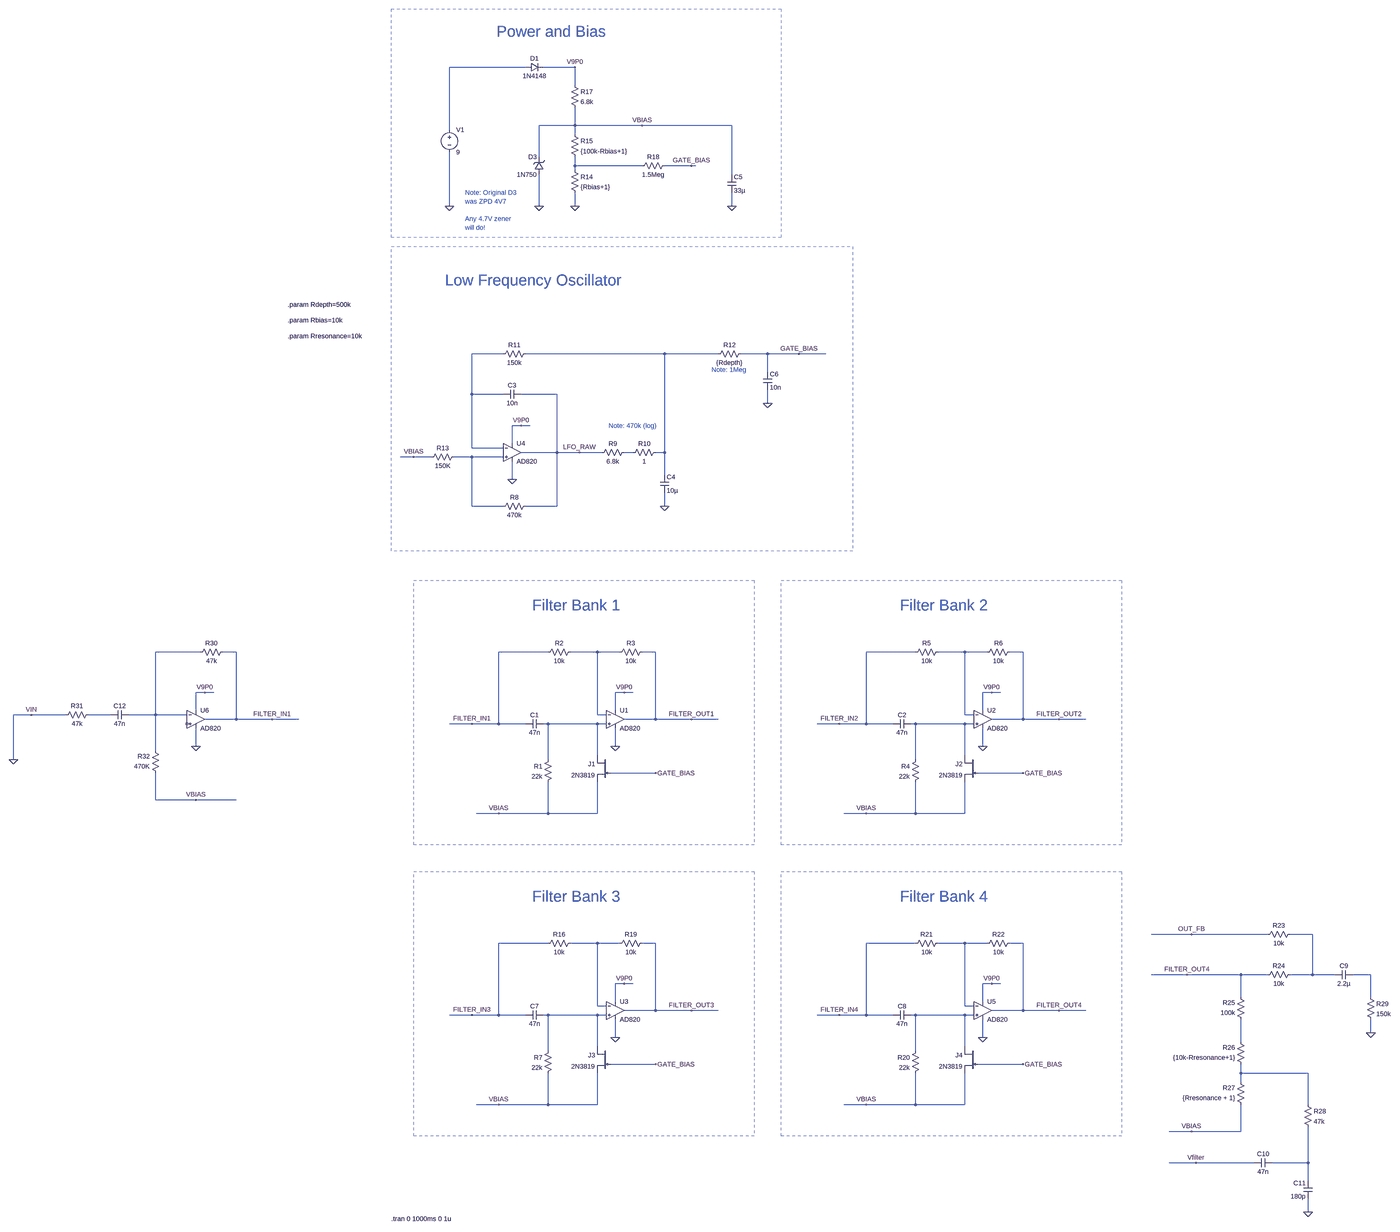
[diagram p0: schematic colorsound-phase-x.asc, whole sheet]
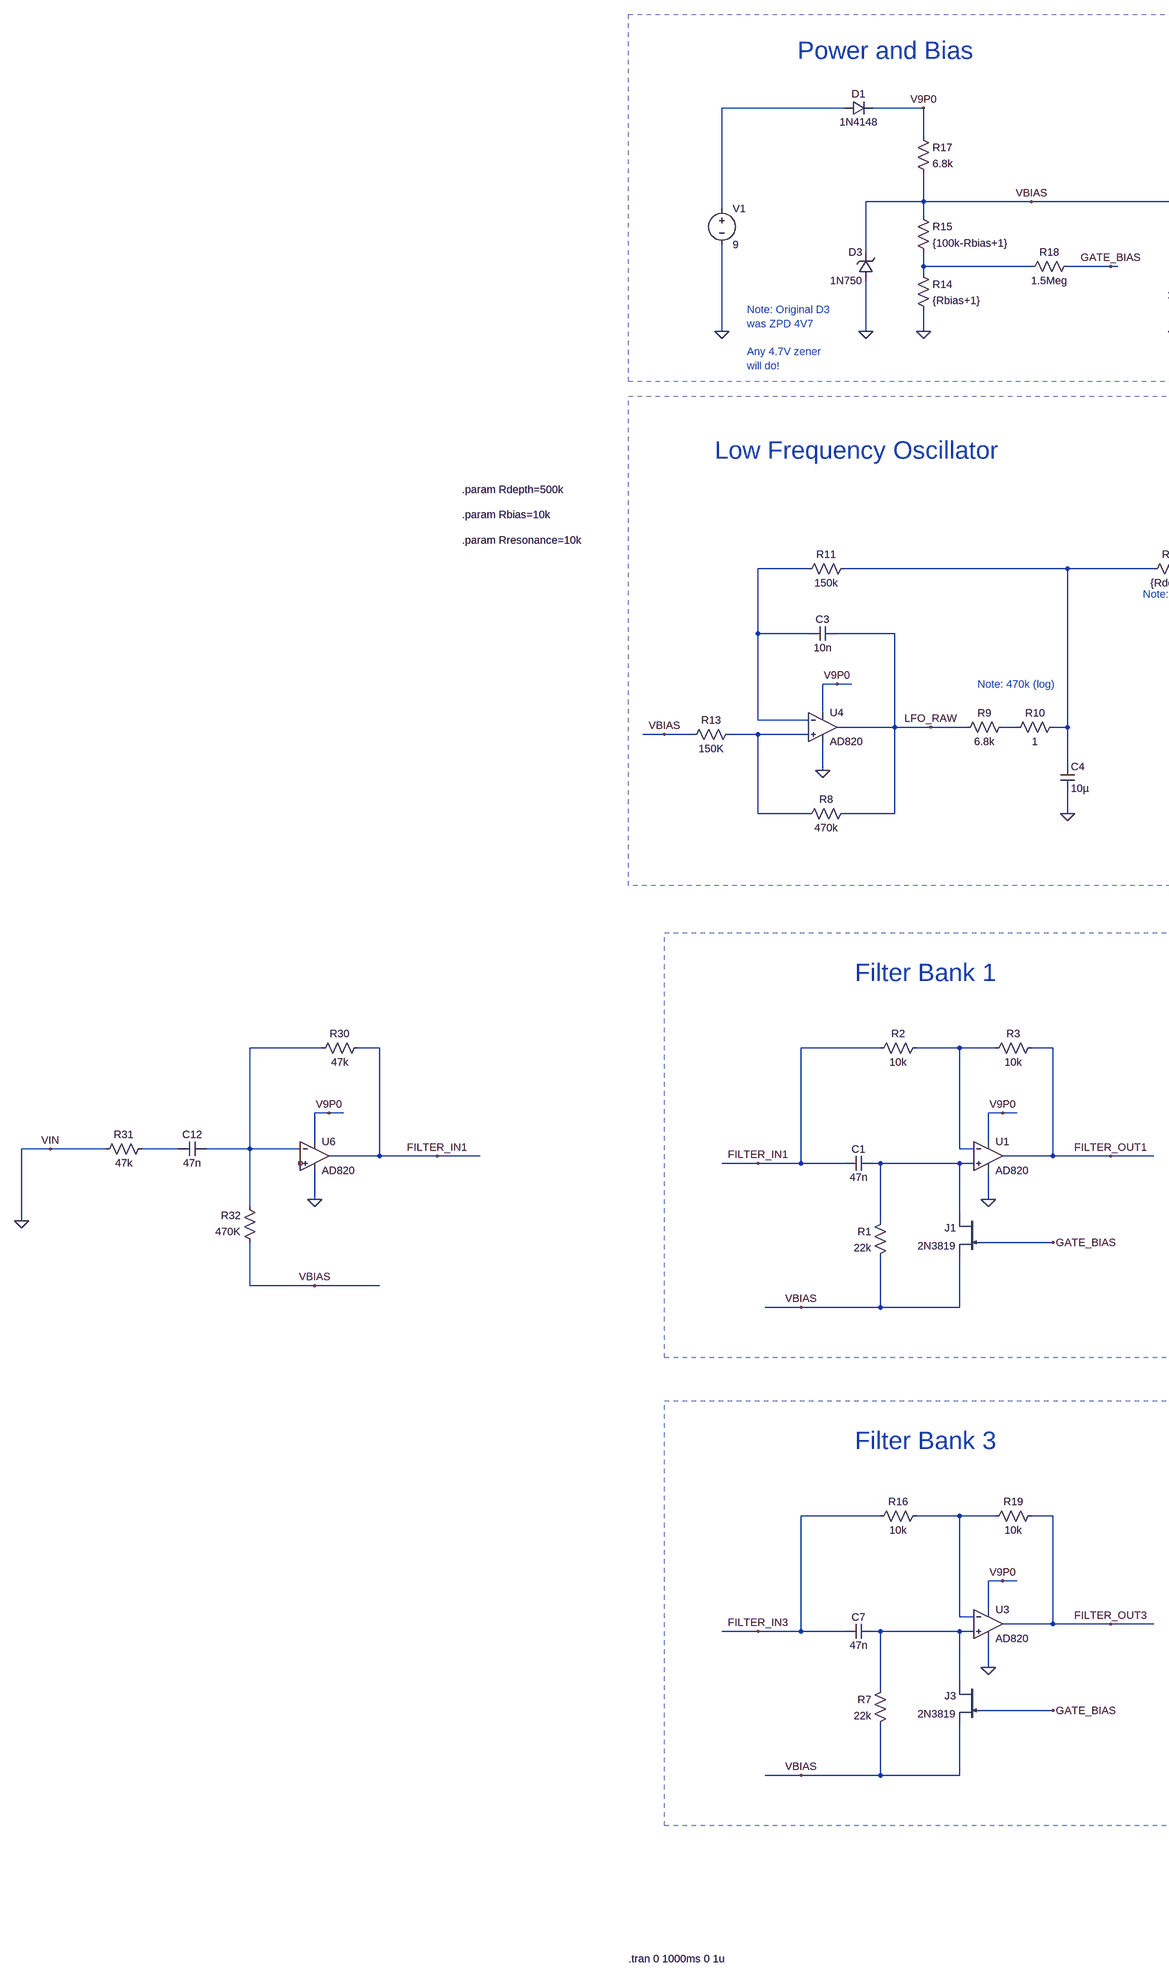
[diagram p1: schematic colorsound-phase-x.asc, part, row 1 of 1, column 1 of 2]
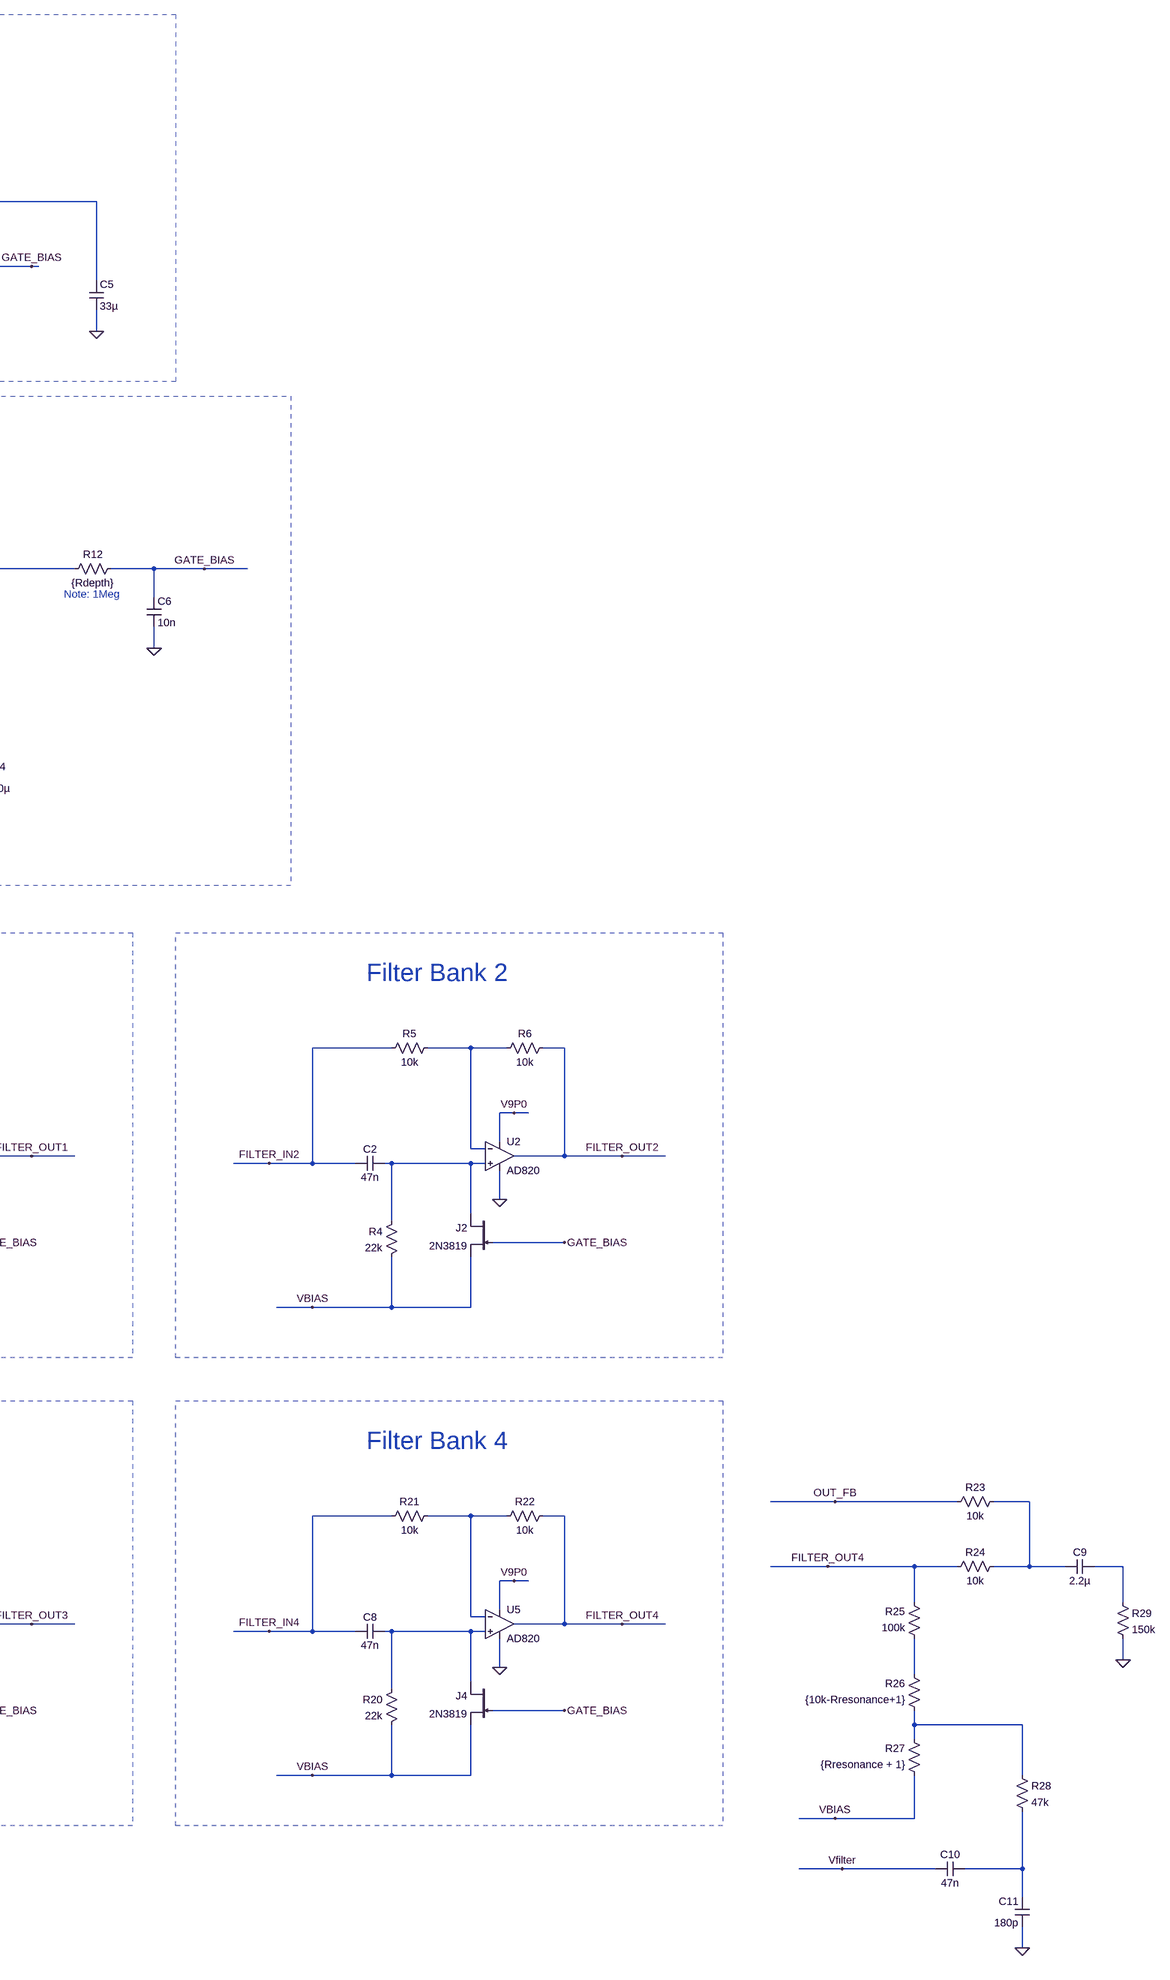
[diagram p2: schematic colorsound-phase-x.asc, part, row 1 of 1, column 2 of 2]
colorsound-phase-x.asc, the LTspice schematic file:
Version 4
SHEET 1 3104 1992
WIRE -160 -2912 -432 -2912
WIRE 16 -2912 -96 -2912
WIRE 16 -2848 16 -2912
WIRE 16 -2704 16 -2768
WIRE 16 -2704 -112 -2704
WIRE 256 -2704 16 -2704
WIRE 576 -2704 256 -2704
WIRE -432 -2688 -432 -2912
WIRE 16 -2672 16 -2704
WIRE -112 -2592 -112 -2704
WIRE 16 -2560 16 -2592
WIRE 256 -2560 16 -2560
WIRE 432 -2560 336 -2560
WIRE 448 -2560 432 -2560
WIRE 16 -2544 16 -2560
WIRE 576 -2528 576 -2704
WIRE -432 -2416 -432 -2608
WIRE -112 -2416 -112 -2528
WIRE 16 -2416 16 -2464
WIRE 576 -2416 576 -2464
WIRE -240 -1888 -352 -1888
WIRE 336 -1888 -160 -1888
WIRE 528 -1888 336 -1888
WIRE 704 -1888 608 -1888
WIRE 816 -1888 704 -1888
WIRE 912 -1888 816 -1888
WIRE 704 -1824 704 -1888
WIRE -352 -1744 -352 -1888
WIRE -240 -1744 -352 -1744
WIRE -48 -1744 -176 -1744
WIRE 704 -1712 704 -1760
WIRE -176 -1632 -208 -1632
WIRE -144 -1632 -176 -1632
WIRE -208 -1568 -208 -1632
WIRE -352 -1552 -352 -1744
WIRE -240 -1552 -352 -1552
WIRE -48 -1536 -48 -1744
WIRE -48 -1536 -176 -1536
WIRE 32 -1536 -48 -1536
WIRE 112 -1536 32 -1536
WIRE 224 -1536 192 -1536
WIRE 336 -1536 336 -1888
WIRE 336 -1536 304 -1536
WIRE -560 -1520 -608 -1520
WIRE -496 -1520 -560 -1520
WIRE -352 -1520 -416 -1520
WIRE -240 -1520 -352 -1520
WIRE 336 -1456 336 -1536
WIRE -208 -1440 -208 -1504
WIRE -352 -1344 -352 -1520
WIRE -240 -1344 -352 -1344
WIRE -48 -1344 -48 -1536
WIRE -48 -1344 -160 -1344
WIRE 336 -1344 336 -1392
WIRE -1408 -48 -1568 -48
WIRE -1280 -48 -1328 -48
WIRE -80 -48 -256 -48
WIRE 96 -48 0 -48
WIRE 176 -48 96 -48
WIRE 304 -48 256 -48
WIRE 1232 -48 1056 -48
WIRE 1408 -48 1312 -48
WIRE 1488 -48 1408 -48
WIRE 1616 -48 1568 -48
WIRE -1392 96 -1424 96
WIRE -1360 96 -1392 96
WIRE 192 96 160 96
WIRE 224 96 192 96
WIRE 1504 96 1472 96
WIRE 1536 96 1504 96
WIRE -1424 160 -1424 96
WIRE 160 160 160 96
WIRE 1472 160 1472 96
WIRE -2128 176 -2192 176
WIRE -1888 176 -2128 176
WIRE -1728 176 -1808 176
WIRE -1568 176 -1568 -48
WIRE -1568 176 -1664 176
WIRE -1456 176 -1568 176
WIRE 96 176 96 -48
WIRE 128 176 96 176
WIRE 1408 176 1408 -48
WIRE 1440 176 1408 176
WIRE -1280 192 -1280 -48
WIRE -1280 192 -1392 192
WIRE -1152 192 -1280 192
WIRE -1056 192 -1152 192
WIRE 304 192 304 -48
WIRE 304 192 192 192
WIRE 432 192 304 192
WIRE 528 192 432 192
WIRE 1616 192 1616 -48
WIRE 1616 192 1504 192
WIRE 1744 192 1616 192
WIRE 1840 192 1744 192
WIRE -352 208 -432 208
WIRE -256 208 -256 -48
WIRE -256 208 -352 208
WIRE -160 208 -256 208
WIRE -80 208 -96 208
WIRE 96 208 -80 208
WIRE 128 208 96 208
WIRE 960 208 880 208
WIRE 1056 208 1056 -48
WIRE 1056 208 960 208
WIRE 1152 208 1056 208
WIRE 1232 208 1216 208
WIRE 1408 208 1232 208
WIRE 1440 208 1408 208
WIRE -1424 288 -1424 224
WIRE 160 288 160 224
WIRE 1472 288 1472 224
WIRE -1568 304 -1568 176
WIRE 96 320 96 208
WIRE 1408 320 1408 208
WIRE -2192 336 -2192 176
WIRE -80 336 -80 208
WIRE 1232 336 1232 208
WIRE 304 384 144 384
WIRE 1616 384 1456 384
WIRE -1568 480 -1568 384
WIRE -1424 480 -1568 480
WIRE -1280 480 -1424 480
WIRE -256 528 -336 528
WIRE -80 528 -80 416
WIRE -80 528 -256 528
WIRE 96 528 96 416
WIRE 96 528 -80 528
WIRE 1056 528 976 528
WIRE 1232 528 1232 416
WIRE 1232 528 1056 528
WIRE 1408 528 1408 416
WIRE 1408 528 1232 528
WIRE 2384 960 2240 960
WIRE 2656 960 2384 960
WIRE 2816 960 2736 960
WIRE -80 992 -256 992
WIRE 96 992 0 992
WIRE 176 992 96 992
WIRE 304 992 256 992
WIRE 1232 992 1056 992
WIRE 1408 992 1312 992
WIRE 1488 992 1408 992
WIRE 1616 992 1568 992
WIRE 2368 1104 2240 1104
WIRE 2560 1104 2368 1104
WIRE 2656 1104 2560 1104
WIRE 2816 1104 2816 960
WIRE 2816 1104 2736 1104
WIRE 2896 1104 2816 1104
WIRE 3024 1104 2960 1104
WIRE 192 1136 160 1136
WIRE 224 1136 192 1136
WIRE 1504 1136 1472 1136
WIRE 1536 1136 1504 1136
WIRE 2560 1184 2560 1104
WIRE 3024 1184 3024 1104
WIRE 160 1200 160 1136
WIRE 1472 1200 1472 1136
WIRE 96 1216 96 992
WIRE 128 1216 96 1216
WIRE 1408 1216 1408 992
WIRE 1440 1216 1408 1216
WIRE 304 1232 304 992
WIRE 304 1232 192 1232
WIRE 432 1232 304 1232
WIRE 528 1232 432 1232
WIRE 1616 1232 1616 992
WIRE 1616 1232 1504 1232
WIRE 1744 1232 1616 1232
WIRE 1840 1232 1744 1232
WIRE -352 1248 -432 1248
WIRE -256 1248 -256 992
WIRE -256 1248 -352 1248
WIRE -160 1248 -256 1248
WIRE -80 1248 -96 1248
WIRE 96 1248 -80 1248
WIRE 128 1248 96 1248
WIRE 960 1248 880 1248
WIRE 1056 1248 1056 992
WIRE 1056 1248 960 1248
WIRE 1152 1248 1056 1248
WIRE 1232 1248 1216 1248
WIRE 1408 1248 1232 1248
WIRE 1440 1248 1408 1248
WIRE 3024 1312 3024 1264
WIRE 160 1328 160 1264
WIRE 1472 1328 1472 1264
WIRE 2560 1344 2560 1264
WIRE 96 1360 96 1248
WIRE 1408 1360 1408 1248
WIRE -80 1376 -80 1248
WIRE 1232 1376 1232 1248
WIRE 304 1424 144 1424
WIRE 1616 1424 1456 1424
WIRE 2560 1456 2560 1424
WIRE 2800 1456 2560 1456
WIRE 2560 1488 2560 1456
WIRE -256 1568 -336 1568
WIRE -80 1568 -80 1456
WIRE -80 1568 -256 1568
WIRE 96 1568 96 1456
WIRE 96 1568 -80 1568
WIRE 1056 1568 976 1568
WIRE 1232 1568 1232 1456
WIRE 1232 1568 1056 1568
WIRE 1408 1568 1408 1456
WIRE 1408 1568 1232 1568
WIRE 2800 1568 2800 1456
WIRE 2384 1664 2304 1664
WIRE 2560 1664 2560 1568
WIRE 2560 1664 2384 1664
WIRE 2400 1776 2304 1776
WIRE 2608 1776 2400 1776
WIRE 2800 1776 2800 1648
WIRE 2800 1776 2672 1776
WIRE 2800 1840 2800 1776
WIRE 2800 1952 2800 1904
FLAG 304 384 GATE_BIAS
FLAG -208 -1440 0
FLAG 336 -1344 0
FLAG 16 -2416 0
FLAG 576 -2416 0
FLAG 704 -1712 0
FLAG -112 -2416 0
FLAG -432 -2416 0
FLAG 16 -2912 V9P0
FLAG 256 -2704 VBIAS
FLAG -560 -1520 VBIAS
FLAG -176 -1632 V9P0
FLAG 432 -2560 GATE_BIAS
FLAG 816 -1888 GATE_BIAS
FLAG -256 528 VBIAS
FLAG 160 288 0
FLAG 192 96 V9P0
FLAG 432 192 FILTER_OUT1
FLAG -352 208 FILTER_IN1
FLAG 1616 384 GATE_BIAS
FLAG 1056 528 VBIAS
FLAG 1472 288 0
FLAG 1504 96 V9P0
FLAG 1744 192 FILTER_OUT2
FLAG 960 208 FILTER_IN2
FLAG 304 1424 GATE_BIAS
FLAG -256 1568 VBIAS
FLAG 160 1328 0
FLAG 192 1136 V9P0
FLAG 432 1232 FILTER_OUT3
FLAG -352 1248 FILTER_IN3
FLAG 1616 1424 GATE_BIAS
FLAG 1056 1568 VBIAS
FLAG 1472 1328 0
FLAG 1504 1136 V9P0
FLAG 1744 1232 FILTER_OUT4
FLAG 960 1248 FILTER_IN4
FLAG 2384 1664 VBIAS
FLAG 2800 1952 0
FLAG 2400 1776 Vfilter
FLAG 3024 1312 0
FLAG 2384 960 OUT_FB
FLAG -1424 288 0
FLAG -1392 96 V9P0
FLAG -1152 192 FILTER_IN1
FLAG 2368 1104 FILTER_OUT4
FLAG -1424 480 VBIAS
FLAG -2192 336 0
FLAG -2128 176 VIN
FLAG 32 -1536 LFO_RAW
SYMBOL OpAmps\\AD820 160 128 R0
SYMATTR InstName U1
SYMBOL njf 144 320 M0
SYMATTR InstName J1
SYMATTR Value 2N3819
SYMBOL res -64 320 M0
SYMATTR InstName R1
SYMATTR Value 22k
SYMBOL cap -96 192 R90
WINDOW 0 0 32 VBottom 2
WINDOW 3 32 32 VTop 2
SYMATTR InstName C1
SYMATTR Value 47n
SYMBOL res 16 -64 R90
WINDOW 0 0 56 VBottom 2
WINDOW 3 32 56 VTop 2
SYMATTR InstName R2
SYMATTR Value 10k
SYMBOL res 272 -64 R90
WINDOW 0 0 56 VBottom 2
WINDOW 3 32 56 VTop 2
SYMATTR InstName R3
SYMATTR Value 10k
SYMBOL OpAmps\\AD820 -208 -1600 R0
SYMATTR InstName U4
SYMBOL cap -176 -1760 R90
WINDOW 0 0 32 VBottom 2
WINDOW 3 32 32 VTop 2
SYMATTR InstName C3
SYMATTR Value 10n
SYMBOL res -144 -1360 R90
WINDOW 0 0 56 VBottom 2
WINDOW 3 32 56 VTop 2
SYMATTR InstName R8
SYMATTR Value 470k
SYMBOL res 208 -1552 R90
WINDOW 0 0 56 VBottom 2
WINDOW 3 32 56 VTop 2
SYMATTR InstName R9
SYMATTR Value 6.8k
SYMBOL res 320 -1552 R90
WINDOW 0 0 56 VBottom 2
WINDOW 3 32 56 VTop 2
SYMATTR InstName R10
SYMATTR Value 1
SYMBOL res -144 -1904 R90
WINDOW 0 0 56 VBottom 2
WINDOW 3 32 56 VTop 2
SYMATTR InstName R11
SYMATTR Value 150k
SYMBOL res 512 -1872 R270
WINDOW 0 32 56 VTop 2
WINDOW 3 0 56 VBottom 2
SYMATTR InstName R12
SYMATTR Value {Rdepth}
SYMBOL cap 320 -1456 R0
SYMATTR InstName C4
SYMATTR Value 10µ
SYMBOL res -400 -1536 R90
WINDOW 0 0 56 VBottom 2
WINDOW 3 32 56 VTop 2
SYMATTR InstName R13
SYMATTR Value 150K
SYMBOL cap 560 -2528 R0
SYMATTR InstName C5
SYMATTR Value 33µ
SYMBOL res 0 -2560 R0
SYMATTR InstName R14
SYMATTR Value {Rbias+1}
SYMBOL res 0 -2688 R0
SYMATTR InstName R15
SYMATTR Value {100k-Rbias+1}
SYMBOL cap 688 -1824 R0
SYMATTR InstName C6
SYMATTR Value 10n
SYMBOL voltage -432 -2704 R0
WINDOW 123 0 0 Left 0
WINDOW 39 0 0 Left 0
SYMATTR InstName V1
SYMATTR Value 9
SYMBOL diode -160 -2896 R270
WINDOW 0 32 32 VTop 2
WINDOW 3 0 32 VBottom 2
SYMATTR InstName D1
SYMATTR Value 1N4148
SYMBOL res 0 -2864 R0
SYMATTR InstName R17
SYMATTR Value 6.8k
SYMBOL res 352 -2576 R90
WINDOW 0 0 56 VBottom 2
WINDOW 3 32 56 VTop 2
SYMATTR InstName R18
SYMATTR Value 1.5Meg
SYMBOL zener -96 -2528 R180
WINDOW 0 24 64 Left 2
WINDOW 3 24 0 Left 2
SYMATTR InstName D3
SYMATTR Value 1N750
SYMBOL OpAmps\\AD820 1472 128 R0
SYMATTR InstName U2
SYMBOL njf 1456 320 M0
SYMATTR InstName J2
SYMATTR Value 2N3819
SYMBOL res 1248 320 M0
SYMATTR InstName R4
SYMATTR Value 22k
SYMBOL cap 1216 192 R90
WINDOW 0 0 32 VBottom 2
WINDOW 3 32 32 VTop 2
SYMATTR InstName C2
SYMATTR Value 47n
SYMBOL res 1328 -64 R90
WINDOW 0 0 56 VBottom 2
WINDOW 3 32 56 VTop 2
SYMATTR InstName R5
SYMATTR Value 10k
SYMBOL res 1584 -64 R90
WINDOW 0 0 56 VBottom 2
WINDOW 3 32 56 VTop 2
SYMATTR InstName R6
SYMATTR Value 10k
SYMBOL OpAmps\\AD820 160 1168 R0
SYMATTR InstName U3
SYMBOL njf 144 1360 M0
SYMATTR InstName J3
SYMATTR Value 2N3819
SYMBOL res -64 1360 M0
SYMATTR InstName R7
SYMATTR Value 22k
SYMBOL cap -96 1232 R90
WINDOW 0 0 32 VBottom 2
WINDOW 3 32 32 VTop 2
SYMATTR InstName C7
SYMATTR Value 47n
SYMBOL res 16 976 R90
WINDOW 0 0 56 VBottom 2
WINDOW 3 32 56 VTop 2
SYMATTR InstName R16
SYMATTR Value 10k
SYMBOL res 272 976 R90
WINDOW 0 0 56 VBottom 2
WINDOW 3 32 56 VTop 2
SYMATTR InstName R19
SYMATTR Value 10k
SYMBOL OpAmps\\AD820 1472 1168 R0
SYMATTR InstName U5
SYMBOL njf 1456 1360 M0
SYMATTR InstName J4
SYMATTR Value 2N3819
SYMBOL res 1248 1360 M0
SYMATTR InstName R20
SYMATTR Value 22k
SYMBOL cap 1216 1232 R90
WINDOW 0 0 32 VBottom 2
WINDOW 3 32 32 VTop 2
SYMATTR InstName C8
SYMATTR Value 47n
SYMBOL res 1328 976 R90
WINDOW 0 0 56 VBottom 2
WINDOW 3 32 56 VTop 2
SYMATTR InstName R21
SYMATTR Value 10k
SYMBOL res 1584 976 R90
WINDOW 0 0 56 VBottom 2
WINDOW 3 32 56 VTop 2
SYMATTR InstName R22
SYMATTR Value 10k
SYMBOL res 2752 944 R90
WINDOW 0 0 56 VBottom 2
WINDOW 3 32 56 VTop 2
SYMATTR InstName R23
SYMATTR Value 10k
SYMBOL res 2752 1088 R90
WINDOW 0 0 56 VBottom 2
WINDOW 3 32 56 VTop 2
SYMATTR InstName R24
SYMATTR Value 10k
SYMBOL res 2576 1280 R180
WINDOW 0 36 76 Left 2
WINDOW 3 36 40 Left 2
SYMATTR InstName R25
SYMATTR Value 100k
SYMBOL res 2576 1440 R180
WINDOW 0 36 76 Left 2
WINDOW 3 36 40 Left 2
SYMATTR InstName R26
SYMATTR Value {10k-Rresonance+1}
SYMBOL res 2576 1584 R180
WINDOW 0 36 76 Left 2
WINDOW 3 36 40 Left 2
SYMATTR InstName R27
SYMATTR Value {Rresonance + 1}
SYMBOL cap 2960 1088 R90
WINDOW 0 0 32 VBottom 2
WINDOW 3 32 32 VTop 2
SYMATTR InstName C9
SYMATTR Value 2.2µ
SYMBOL res 2784 1552 R0
SYMATTR InstName R28
SYMATTR Value 47k
SYMBOL cap 2672 1760 R90
WINDOW 0 0 32 VBottom 2
WINDOW 3 32 32 VTop 2
SYMATTR InstName C10
SYMATTR Value 47n
SYMBOL cap 2816 1904 R180
WINDOW 0 24 56 Left 2
WINDOW 3 24 8 Left 2
SYMATTR InstName C11
SYMATTR Value 180p
SYMBOL res 3008 1168 R0
SYMATTR InstName R29
SYMATTR Value 150k
SYMBOL OpAmps\\AD820 -1424 128 R0
SYMATTR InstName U6
SYMBOL res -1312 -64 R90
WINDOW 0 0 56 VBottom 2
WINDOW 3 32 56 VTop 2
SYMATTR InstName R30
SYMATTR Value 47k
SYMBOL cap -1664 160 R90
WINDOW 0 0 32 VBottom 2
WINDOW 3 32 32 VTop 2
SYMATTR InstName C12
SYMATTR Value 47n
SYMBOL res -1792 160 R90
WINDOW 0 0 56 VBottom 2
WINDOW 3 32 56 VTop 2
SYMATTR InstName R31
SYMATTR Value 47k
SYMBOL res -1552 400 R180
WINDOW 0 36 76 Left 2
WINDOW 3 36 40 Left 2
SYMATTR InstName R32
SYMATTR Value 470K
TEXT 504 -1832 Left 2 ;Note: 1Meg
TEXT 136 -1632 Left 2 ;Note: 470k (log)
TEXT -376 -2464 Left 2 ;Note: Original D3 \nwas ZPD 4V7 \n \nAny 4.7V zener \nwill do!
TEXT -136 -216 Left 5 ;Filter Bank 1
TEXT 1176 -216 Left 5 ;Filter Bank 2
TEXT -136 824 Left 5 ;Filter Bank 3
TEXT 1176 824 Left 5 ;Filter Bank 4
TEXT -640 1976 Left 2 !.tran 0 1000ms 0 1u
TEXT -1096 -2064 Left 2 !.param Rdepth=500k
TEXT -1096 -2008 Left 2 !.param Rbias=10k
TEXT -1096 -1952 Left 2 !.param Rresonance=10k
TEXT -264 -3040 Left 5 ;Power and Bias
TEXT -448 -2152 Left 5 ;Low Frequency Oscillator
RECTANGLE Normal 1008 -1184 -640 -2272 2
RECTANGLE Normal 656 640 -560 -304 2
RECTANGLE Normal 1968 640 752 -304 2
RECTANGLE Normal 656 1680 -560 736 2
RECTANGLE Normal 1968 1680 752 736 2
RECTANGLE Normal 752 -2304 -640 -3120 2

The netlist it stands for:
* colorsound-phase-x.asc
XU1 N011 N008 V9P0 0 FILTER_OUT1 AD820  ; pins In+ In- V+ V- OUT
J1 N011 GATE_BIAS VBIAS 2N3819
R1 N011 VBIAS 22k
C1 N011 FILTER_IN1 47n
R2 N008 FILTER_IN1 10k
R3 FILTER_OUT1 N008 10k
XU4 N006 N003 V9P0 0 LFO_RAW AD820  ; pins In+ In- V+ V- OUT
C3 LFO_RAW N003 10n
R8 LFO_RAW N006 470k
R9 N005 LFO_RAW 6.8k
R10 N004 N005 1
R11 N004 N003 150k
R12 N004 GATE_BIAS {Rdepth}
C4 N004 0 10µ
R13 N006 VBIAS 150K
C5 VBIAS 0 33µ
R14 N002 0 {Rbias+1}
R15 VBIAS N002 {100k-Rbias+1}
C6 GATE_BIAS 0 10n
V1 N001 0 9
D1 N001 V9P0 1N4148
R17 V9P0 VBIAS 6.8k
R18 GATE_BIAS N002 1.5Meg
D3 0 VBIAS 1N750
XU2 N012 N009 V9P0 0 FILTER_OUT2 AD820  ; pins In+ In- V+ V- OUT
J2 N012 GATE_BIAS VBIAS 2N3819
R4 N012 VBIAS 22k
C2 N012 FILTER_IN2 47n
R5 N009 FILTER_IN2 10k
R6 FILTER_OUT2 N009 10k
XU3 N017 N014 V9P0 0 FILTER_OUT3 AD820  ; pins In+ In- V+ V- OUT
J3 N017 GATE_BIAS VBIAS 2N3819
R7 N017 VBIAS 22k
C7 N017 FILTER_IN3 47n
R16 N014 FILTER_IN3 10k
R19 FILTER_OUT3 N014 10k
XU5 N018 N015 V9P0 0 FILTER_OUT4 AD820  ; pins In+ In- V+ V- OUT
J4 N018 GATE_BIAS VBIAS 2N3819
R20 N018 VBIAS 22k
C8 N018 FILTER_IN4 47n
R21 N015 FILTER_IN4 10k
R22 FILTER_OUT4 N015 10k
R23 N013 OUT_FB 10k
R24 N013 FILTER_OUT4 10k
R25 N019 FILTER_OUT4 100k
R26 N020 N019 {10k-Rresonance+1}
R27 VBIAS N020 {Rresonance + 1}
C9 N016 N013 2.2µ
R28 N020 N021 47k
C10 N021 Vfilter 47n
C11 0 N021 180p
R29 N016 0 150k
XU6 NC_01 N007 V9P0 0 FILTER_IN1 AD820  ; pins In+ In- V+ V- OUT
R30 FILTER_IN1 N007 47k
C12 N007 N010 47n
R31 N010 0 47k
R32 VBIAS N007 470K
.model D D
.lib standard.dio
.model NJF NJF
.model PJF PJF
.lib standard.jft
* Note: 1Meg
* Note: 470k (log)
* Note: Original D3
* was ZPD 4V7
* Any 4.7V zener
* will do!
* Filter Bank 1
* Filter Bank 2
* Filter Bank 3
* Filter Bank 4
.tran 0 1000ms 0 1u
.param Rdepth=500k
.param Rbias=10k
.param Rresonance=10k
* Power and Bias
* Low Frequency Oscillator
.backanno
.end